# EasyEDA Pro project ProProject_P1_2024-06-12.epro, schematic Schematic2_1
Create Date: 2024-05-17; Page Name: P1; Project Name: P1; Schematic Name: Schematic2_1; Update Date: 2024-06-08; Company: 嘉立创EDA; Page Size: A3; Version: V1.0
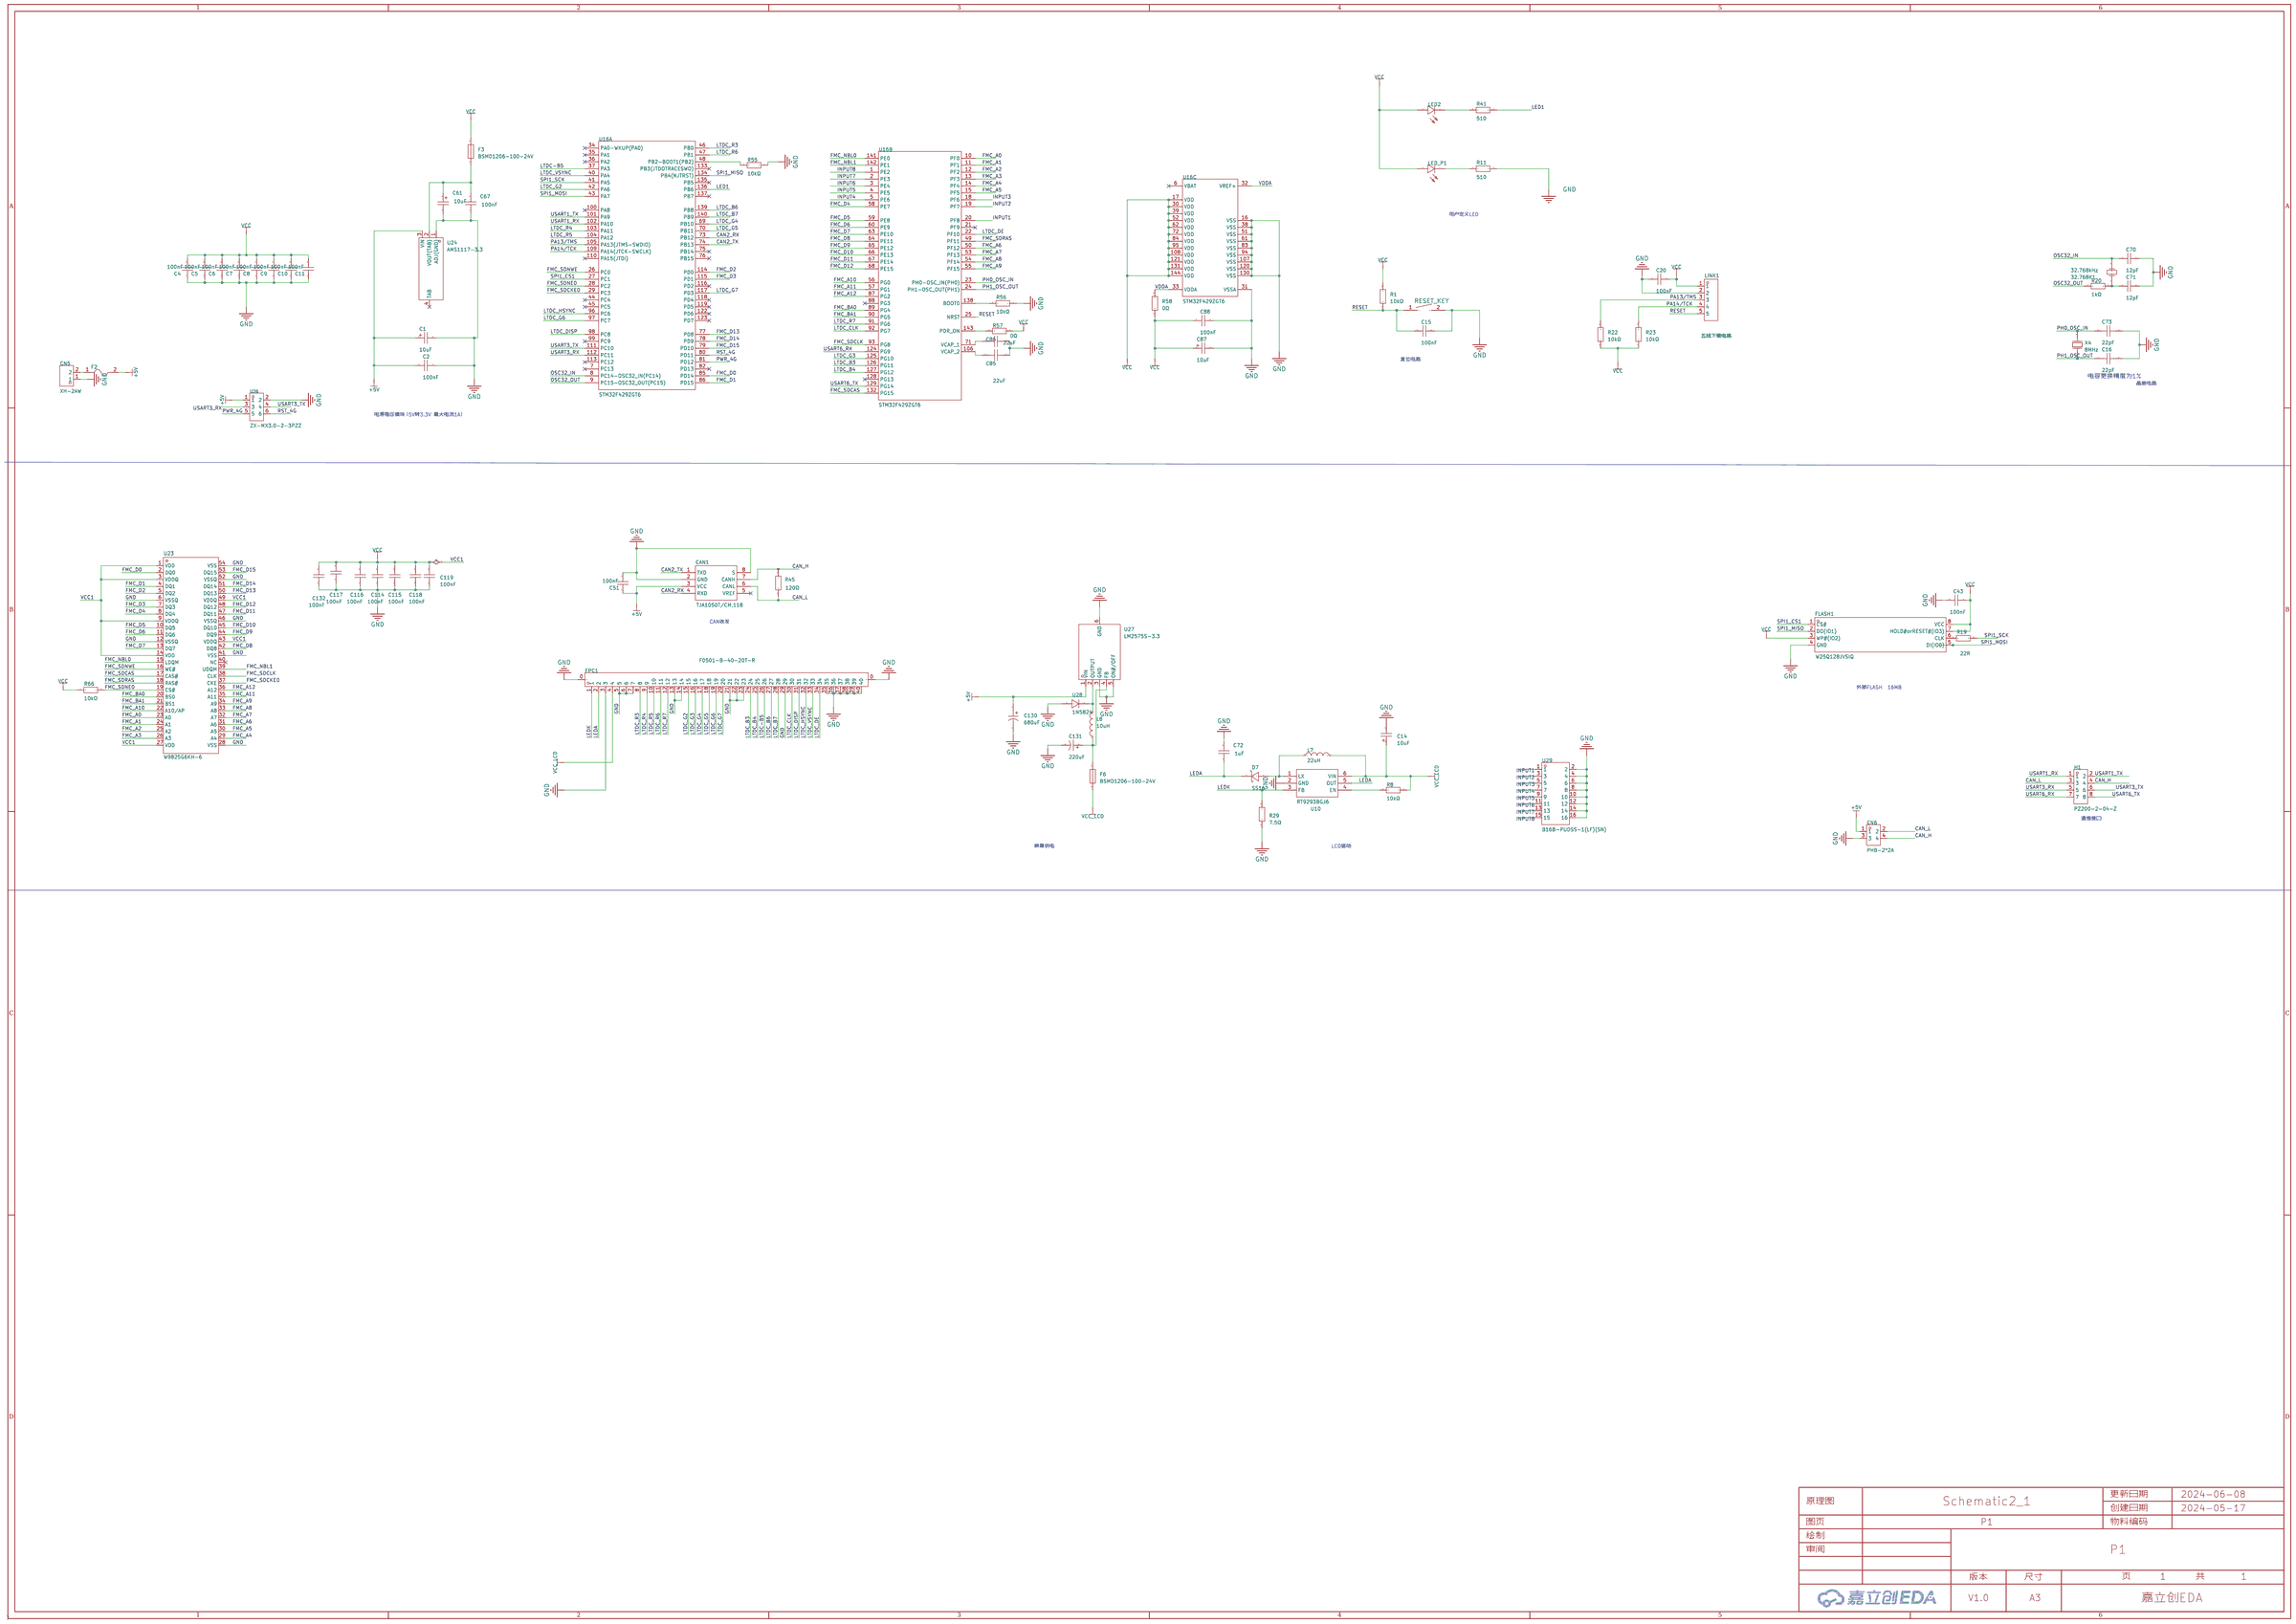
[diagram p0: schematic sheet]

## Parts
32.768K1  32.768kHz  [OSC-TH_BD2.0-P0.70-D0.3]
C1  10uF  [CAP-SMD_L3.2-W1.6-RD]
C2  100nF  [C0805]
C4  100nF  [C0805]
C5  100nF  [C0805]
C6  100nF  [C0805]
C7  100nF  [C0805]
C8  100nF  [C0805]
C9  100nF  [C0805]
C10  100nF  [C0805]
C11  100nF  [C0805]
C14  10uF  [CAP-SMD_L3.2-W1.6-RD]
C15  100nF  [C0805]
C16  22pF  [C0805]
C20  100nF  [C0805]
C43  100nF  [C0805]
C51  100nF  [C0805]
C61  10uF  [CAP-SMD_L3.2-W1.6-RD]
C67  100nF  [C0805]
C70  12pF  [C0805]
C71  12pF  [C0805]
C72  1uF  [C0805]
C73  22pF  [C0805]
C85  22uF  [C0805]
C86  22uF  [C0805]
C87  10uF  [CAP-SMD_L3.2-W1.6-RD]
C88  100nF  [C0805]
C114  100nF  [C0805]
C115  100nF  [C0805]
C116  100nF  [C0805]
C117  100nF  [C0805]
C118  100nF  [C0805]
C119  100nF  [C0805]
C130  680uF  [CAP-SMD_BD10.0-L10.3-W10.3-LS10.9-FD]
C131  220uF  [CAP-SMD_BD8.0-L8.3-W8.3-RD]
C132  100nF  [C0805]
CAN1  TJA1050T/CM,118  [SOIC-8_L5.0-W4.0-P1.27-LS6.0-BL]
CN5  XH-2AW  [CONN-TH_XH-2AW_C2908611]
CN6  PHB-2*2A  [CONN-TH_PHB-2-2A]
D7  SS16  [SMA_L4.4-W2.6-LS5.0-RD]
F2  BSMD1206-200-12V  [F1206]
F3  BSMD1206-100-24V  [F1206]
F6  BSMD1206-100-24V  [F1206]
FLASH1  W25Q128JVSIQ  [SOIC-8_L5.3-W5.3-P1.27-LS8.0-BL]
FPC1  F0501-B-40-20T-R  [FPC-SMD_40P-P0.50_L4.4-W25.6]
H1  PZ200-2-04-Z  [HDR-TH_8P-P2.00-V-M-R2-C4-S2.00]
K2  RESET_KEY  [SW-SMD_L6.1-W3.6-LS8.0]
L7  22uH  [IND-SMD_L7.3-W6.6_MHCI06030]
L8  10uH  [IND-SMD_L7.6-W7.6]
LED2  NCD0603W1  [LED0603-RD]
LED_P1  NCD0603W1  [LED0603-RD]
LINK1  五线下载电路  [HDR-TH_5P-P2.54-H-M-W10.0-N]
R1  10kΩ  [R0805]
R8  10kΩ  [R0805]
R11  510  [R0805]
R19  22R  [R0805]
R20  1kΩ  [R0805]
R22  10kΩ  [R0805]
R23  10kΩ  [R0805]
R29  7.5Ω  [R1206]
R41  510  [R0805]
R45  120Ω  [R0805]
R55  10kΩ  [R0805]
R56  10kΩ  [R0805]
R57  0Ω  [R0805]
R58  0Ω  [R0805]
R66  10kΩ  [R0805]
U10  -  [SOT-23-6_L2.9-W1.6-P0.95-LS2.8-BR]
U16  STM32F429ZGT6  [LQFP-144_L20.0-W20.0-P0.50-LS22.0-BL]  (sections 1,2,3)
U23  W9825G6KH-6  [TSOP-54_L22.2-W10.2-P0.80-LS11.8-BL]
U24  AMS1117-3.3  [SOT-223-4_L6.5-W3.5-P2.30-LS7.0-BR]
U26  ZX-MX3.0-2-3PZZ  [CONN-TH_6P-P3.00_HC-MX3.0-2X3A]
U27  LM2575S-3.3  [TO-263-5_L10.0-W8.4-P1.70-LS15.3-BR]
U28  1N5824  [DO-201AD_BD5.3-L9.5-P13.50-D1.4-RD]
U29  B16B-PUDSS-1(LF)(SN)  [CONN-TH_B16B-PUDSS-1]
X4  8MHz  [CRYSTAL-SMD_L11.5-W4.8-LS12.7]

## Library data of the parts
32.768K1 = X206032768KGB2SC: 晶振类型:圆柱体晶振;频率:32.768kHz;频率公差:±10ppm;频率稳定度:-;负载电容:12.5pF;工作温度:-20~+70;; LCSC Part Name: 32.768kHz ±10ppm 12.5pF YT-26; Supplier Part: C2236; Manufacturer: YXC扬兴科技; Supplier Footprint: DT-26; JLCPCB Part Class: Extended Part; Datasheet: https://atta.szlcsc.com/upload/public/pdf/source/20210329/C13712_F7F11DC87370623B2CDEB0B445E6F76E.pdf; Supplier: LCSC; Crystal Type: 圆柱体晶振; Frequency Tolerance: ±10ppm; Load Capacitance: 12.5pF; Operating Temperature: -20~+70
C1 C14 C61 C87 = TAJA106K010RNJ: 额定电压:10V;工作温度:-55~+125;等效串联电阻:3Ω 100kHz;容值:10uF;精度:±10%;; LCSC Part Name: 10uF ±10% 10V; Supplier Part: C7177; Manufacturer: Kyocera AVX; Supplier Footprint: CASE-A_3216; JLCPCB Part Class: Extended Part; Datasheet: https://atta.szlcsc.com/upload/public/pdf/source/20160107/1457707748330.pdf; Supplier: LCSC; Rated Voltage: 10V; Operating Temperature: -55~+125; Equivalent Series Resistance(ESR): 3Ω 100kHz; Tolerance: ±10%
C2 C4-C11 C15 C20 C43 C51 C67 C88 C114-C119 C132 = CC0805KRX7R9BB104: 容值:100nF;精度:±10%;额定电压:50V;材质(温度系数):X7R;; LCSC Part Name: 100nF ±10% 50V; Supplier Part: C49678; Manufacturer: YAGEO(国巨); Supplier Footprint: 0805; JLCPCB Part Class: Basic Part; Datasheet: https://atta.szlcsc.com/upload/public/pdf/source/20151026/1457707504898.pdf; Supplier: LCSC; Tolerance: ±10%; Voltage Rated: 50V; Temperature Coefficient: X7R
C16 C73 = 0805CG220F500NT: 容值:22pF;精度:±1%;额定电压:50V;材质(温度系数):C0G;; LCSC Part Name: 22pF ±1% 50V; Supplier Part: C190088; Manufacturer: FH(风华); Supplier Footprint: 0805; JLCPCB Part Class: Extended Part; Datasheet: https://atta.szlcsc.com/upload/public/pdf/source/20180403/C190088_56850D1EC15C808EFC445C0BB3B2CDBB.pdf; Supplier: LCSC; Tolerance: ±1%; Voltage Rated: 50V; Temperature Coefficient: C0G
C70 C71 = 0805CG120J500NT: 容值:12pF;精度:±5%;额定电压:50V;材质(温度系数):C0G;; LCSC Part Name: 12pF ±5% 50V; Supplier Part: C1792; Manufacturer: FH(风华); Supplier Footprint: 0805; JLCPCB Part Class: Basic Part; Datasheet: https://atta.szlcsc.com/upload/public/pdf/source/20170923/C1792_1506149354360988551.pdf; Supplier: LCSC; Tolerance: ±5%; Voltage Rated: 50V; Temperature Coefficient: C0G
C72 = CL21B105KBFNNNE: 容值:1uF;精度:±10%;额定电压:50V;材质(温度系数):X7R;; LCSC Part Name: 1uF ±10% 50V; Supplier Part: C28323; Manufacturer: SAMSUNG(三星); Supplier Footprint: 0805; JLCPCB Part Class: Basic Part; Datasheet: https://atta.szlcsc.com/upload/public/pdf/source/20160103/1457707718219.pdf; Supplier: LCSC; Tolerance: ±10%; Voltage Rated: 50V; Temperature Coefficient: X7R
C85 C86 = CL21A226MAYNNNE: 温度系数:X5R;额定电压:25V;精度:±20%;容值:22uF;; LCSC Part Name: 22uF ±20% 25V; Supplier Part: C602037; Manufacturer: SAMSUNG(三星); Supplier Footprint: 0805; JLCPCB Part Class: Extended Part; Datasheet: https://atta.szlcsc.com/upload/public/pdf/source/20200609/C602037_1A0D619693E608A1BF6E80154254E2DB.pdf; Supplier: LCSC; Temperature Coefficient: X5R; Voltage Rated: 25V; Tolerance: ±20%
C130 = GVM1V681M1010: 容值:680uF;精度:±20%;额定电压:35V;纹波电流:1.19A@120Hz;等效串联电阻:60mΩ@120Hz;; LCSC Part Name: 680uF ±20% 35V; Supplier Part: C2980172; Manufacturer: HONOR(荣誉); Supplier Footprint: SMD,D10xL10.5mm; JLCPCB Part Class: 扩展库; Datasheet: https://atta.szlcsc.com/upload/public/pdf/source/20220509/EB2A569F0F3393644DE07704993C28AA.pdf; Supplier: LCSC; Tolerance: ±20%; Rated Voltage: 35V; Ripple Current: 1.19A@120Hz; Equivalent Series Resistance(ESR): 60mΩ@120Hz; φD: 10mm; L: 10.2mm; Lifetime @ Temp: 5000hrs@105℃; Operating Temperature: -55℃~+105℃
C131 = CS1V221M-CRF10: 容值:220uF;精度:±20%;额定电压:35V;纹波电流:-;等效串联电阻:-;; LCSC Part Name: 220uF ±20% 35V; Supplier Part: C97814; Manufacturer: ST(先科); Supplier Footprint: SMD,D8xL10.5mm; JLCPCB Part Class: 扩展库; Datasheet: https://atta.szlcsc.com/upload/public/pdf/source/20170914/C129293_1505359937951968146.pdf; Supplier: LCSC; Tolerance: ±20%; Rated Voltage: 35V; φD: 8mm; L: 10.5mm; Lifetime @ Temp: 2000hrs@105℃; Operating Temperature: -40℃~+105℃
CAN1 = TJA1050T/CM,118: 类型:收发器;协议类别:CAN总线;; Supplier Part: C6952; Manufacturer: NXP(恩智浦); Supplier Footprint: SOIC-8_150mil; JLCPCB Part Class: Basic Part; Datasheet: https://atta.szlcsc.com/upload/public/pdf/source/20140411/1457707042917.pdf; Supplier: LCSC; Type: 收发器; Protocol: CAN总线; Supply Voltage: 4.75V ~ 5.25V
CN5 = XH-2AW_C2908611: 插针结构:1x2P;间距:2.54mm;安装方式:弯插;参考系列:XH;总PIN数:2P;排数:1;每排PIN数:2;行距:-;额定电流:3A;触头材质:黄铜;触头镀层:锡;工作温度范围:-25℃~+85℃;; LCSC Part Name: 1x2P 间距:2.54mm 弯插 系列:XH; Supplier Part: C2908611; Manufacturer: HCTL(华灿天禄); Supplier Footprint: 弯插,P=2.54mm; JLCPCB Part Class: 扩展库; Datasheet: https://atta.szlcsc.com/upload/public/pdf/source/20230711/B565BAF3B11666EF6B81B3605408F2BD.pdf; Supplier: LCSC; Pins Structure: 1x2P; Pitch: 2.54mm; Mounting Style: 弯插; Reference Series: XH; Number of Pins: 2P; Number of Rows: 1; Number of PINs Per Row: 2; Current Rating (Max): 3A; Contact Material: 黄铜; Contact Plating: 锡; Operating Temperature Range: -25℃~+85℃
CN6 = PHB-2*2A_C722944: 插针结构:2x2P;间距:2mm;安装方式:直插;参考系列:-;总PIN数:4P;排数:2;每排PIN数:2;行距:2mm;额定电流:2A;工作温度范围:-25℃~+85℃;; LCSC Part Name: 2x2P 间距:2mm 直插; Supplier Part: C722944; Manufacturer: CAX(创都); Supplier Footprint: 插件,P=2mm; JLCPCB Part Class: 扩展库; Datasheet: https://atta.szlcsc.com/upload/public/pdf/source/20220624/C175EBC2626E0856603CFFC6A18F53BC.pdf; Supplier: LCSC; Pins Structure: 2x2P; Pitch: 2mm; Mounting Style: 直插; Number of Pins: 4P; Number of Rows: 2; Number of PINs Per Row: 2; Row Spacing: 2mm; Current Rating (Max): 2A; Operating Temperature Range: -25℃~+85℃
D7 = SS16_C408259: 正向压降(Vf):700mV@1A;直流反向耐压(Vr):60V;平均整流电流(Io):1A;; LCSC Part Name: 电压:60V 电流:1A; Supplier Part: C408259; Manufacturer: Slkor(萨科微); Supplier Footprint: SMA(DO-214AC); JLCPCB Part Class: 扩展库; Datasheet: https://atta.szlcsc.com/upload/public/pdf/source/20190729/C408259_D3DE34C09D6DBB5845773DDABD83847F.pdf; Supplier: LCSC; Forward Voltage (Vf@If): 700mV@1A; Reverse Voltage (Vr): 60V; Average Rectified Current (Io): 1A
F2 = BSMD1206-200-12V: 最大电压:12V;最大电流:100A;保持电流:2A;跳闸电流:3.5A;; LCSC Part Name: 12V 2A 1206自恢复; Supplier Part: C883135; Manufacturer: BHFUSE(佰宏); Supplier Footprint: 1206; JLCPCB Part Class: 扩展库; Datasheet: https://atta.szlcsc.com/upload/public/pdf/source/20230512/E419278EC8529AAF514173EF221BCF4B.pdf; Supplier: LCSC; Operating Voltage (Max): 12V; Current Rating (Max): 100A; Hold Current: 2A; Trip Current: 3.5A; Power Dissipation: 1W; Resistance - Initial (Ri) (Min): 15mΩ; Resistance - Post Trip (R1) (Max): 80mΩ; Maximum Time to Trip: 1.5s; Operating Temperature: -40℃~+85℃
F3 F6 = BSMD1206-100-24V: 最大电压:24V;最大电流:40A;保持电流:1A;跳闸电流:1.8A;; LCSC Part Name: 1206 1A 24V 佰宏高电压; Supplier Part: C910830; Manufacturer: BHFUSE(佰宏); Supplier Footprint: 1206; JLCPCB Part Class: 扩展库; Datasheet: https://atta.szlcsc.com/upload/public/pdf/source/20230512/E419278EC8529AAF514173EF221BCF4B.pdf; Supplier: LCSC; Operating Voltage (Max): 24V; Current Rating (Max): 40A; Hold Current: 1A; Trip Current: 1.8A; Power Dissipation: 1W; Resistance - Initial (Ri) (Min): 50mΩ; Resistance - Post Trip (R1) (Max): 270mΩ; Maximum Time to Trip: 300ms; Operating Temperature: -40℃~+85℃
FLASH1 = W25Q128JVSIQ_C113767: Supplier Part: C113767; Manufacturer: WINBOND(华邦); Supplier Footprint: SOIC-8-208mil; JLCPCB Part Class: Extended Part; Datasheet: https://atta.szlcsc.com/upload/public/pdf/source/20180329/C113767_097B64D788F6E3FFB2E9CB46CB6C1427.pdf; Supplier: LCSC
FPC1 = F0501-B-40-20T-R: 锁定特性:抽屉式;触点类型:下接;触点数量:40P;间距:0.5mm;安装类型:卧贴;; LCSC Part Name: 间距:0.5mm P数:40P 抽屉式 下接; Supplier Part: C481234; Manufacturer: XFCN(兴飞); Supplier Footprint: SMD,P=0.5mm,卧贴; JLCPCB Part Class: 扩展库; Datasheet: https://atta.szlcsc.com/upload/public/pdf/source/20200107/C481235_885C0C9048A71D2F9507D81192DE73EF.pdf; Supplier: LCSC; Locking Feature: 抽屉式; Contact Type: 下接; Number of Contacts: 40P; Pitch: 0.5mm; Mounting Type: 卧贴; Height Above Board: 2mm
H1 = PZ200-2-04-Z: 插针结构:2x4P;间距:2mm;行距:2mm;圆针/方针:方针;安装类型:直插;排数:双排;总PIN位数:8P;额定电流:1.5A;额定电压:-;配合针长度:4mm;塑高:2mm;端接针长度:2.8mm;触头材质:黄铜;工作温度范围:-40℃~+105℃;焊接温度(最大值):260℃@5S;颜色:黑色;; LCSC Part Name: 2x4P 间距:2mm 方针 直插; Supplier Part: C2905990; Manufacturer: HCTL(华灿天禄); Supplier Footprint: 插件,P=2mm; JLCPCB Part Class: 扩展库; Datasheet: https://atta.szlcsc.com/upload/public/pdf/source/20230609/E9B292E9F4F82C2859D5665FE1B563FB.pdf; Supplier: LCSC; Pin Structure: 2x4P; Pitch: 2mm; Row Spacing: 2mm; Circluar Pins/Square Pins: 方针; Mounting Type: 直插; Number of Rows: 双排; Number of Pins: 8P; Current Rating (Max): 1.5A; Length of Mating Pin: 4mm; Insulation Height: 2mm; Length of End Connection Pin: 2.8mm; Contact Material: 黄铜; Operating Temperature Range: -40℃~+105℃; Soldering Temperature(Max): 260℃@5S; Color: 黑色
K2 = TSA363G25-250B: 触点电流:50mA;额定电压(DC):12V;绝缘电阻:100MΩ;电路结构:单刀单掷;安装方式:立贴;按钮形状:矩形按钮;按钮/盖帽颜色:白色;带灯:无;作用力:250gf@±50gf;机械寿命:50000;工作温度:-25~+70;引脚样式:鸥翼型;开关长度:6.05mm;开关宽度:3.6mm;开关高度:2.5mm;带支架:否;; LCSC Part Name: 3*6*2.5  白柄贴片  250gf; Supplier Part: C354943; Manufacturer: BRIGHT(博瑞泰); Supplier Footprint: SMD; JLCPCB Part Class: Extended Part; Datasheet: https://atta.szlcsc.com/upload/public/pdf/source/20190426/C354943_F8D02988919B0D3B4D493E3C3D798834.pdf; Supplier: LCSC; Contact Current: 50mA; Voltage Rating (DC): 12V; Insulation Resistance: 100MΩ; Circuit: 单刀单掷; Mounting Style: 立贴; Actuator Style: 矩形按钮; Actuator/Cap Color: 白色; With Lamp: 无; Operating Force: 250gf@±50gf; Mechanical Life: 50000; Operating Temperature: -25~+70; Pin Style: 鸥翼型; Switch Length: 6.05mm; Switch Width: 3.6mm; Switch Height: 2.5mm; Strike Gundam: 否
L7 = SMMS0630-220M: 电感值:22uH;精度:±20%;额定电流:-;饱和电流(Isat):3.5A;类型:一体成型电感;; LCSC Part Name: 22uH ±20% 3.5A; Supplier Part: C128694; Manufacturer: SXN(顺翔诺); Supplier Footprint: SMD,6.6x7.3mm; JLCPCB Part Class: 扩展库; Datasheet: https://atta.szlcsc.com/upload/public/pdf/source/20210810/BBF24330FB2F5029F637830BA9C42C0D.pdf; Supplier: LCSC; Tolerance: ±20%; Saturation Current (Isat): 3.5A; DC Resistance (DCR): 135mΩ; Type: 一体成型电感
L8 = B1047AS-100M=P3: 电感值:10uH;精度:±20%;额定电流:2.7A;饱和电流(Isat):-;直流电阻(DCR):53mΩ;; LCSC Part Name: 10uH ±20%; Supplier Part: C160959; Manufacturer: muRata(村田); Supplier Footprint: SMD,7.3x7.3mm; JLCPCB Part Class: 扩展库; Datasheet: https://atta.szlcsc.com/upload/public/pdf/source/20180122/C160959_15166126137741291243.pdf; Supplier: LCSC; Tolerance: ±20%; Rated Current: 2.7A; DC Resistance (DCR): 53mΩ
LED2 LED_P1 = NCD0603W1: 发光颜色:白灯;; LCSC Part Name: 白灯; Supplier Part: C84265; Manufacturer: 国星光电; Supplier Footprint: 0603; JLCPCB Part Class: Extended Part; Datasheet: https://atta.szlcsc.com/upload/public/pdf/source/20200820/C84265_479E6193713348A548E5CD6D9278BF16.pdf; Supplier: LCSC; Emitted Color: 白灯
LINK1 = DZ254W-11-05-65: 间距:2.54mm;总PIN位数:5;排数:1;插针结构:1x5P;行距:-;安装类型:弯插;圆针/方针:方针;额定电流:3A;额定电压:-;配合针长度:6mm;塑高:2.54mm;端接针长度:-;工作温度范围:-;颜色:-;; LCSC Part Name: 2.54mm 1x5P 弯插 方针; Supplier Part: C2935930; Manufacturer: DEALON(德艺隆); Supplier Footprint: 弯插,P=2.54mm; JLCPCB Part Class: Extended Part; Datasheet: https://atta.szlcsc.com/upload/public/pdf/source/20211231/CEC96EEC99F3217E207F74B399519373.pdf; Supplier: LCSC; Pitch: 2.54mm; Number of Pins: 5; Number of Rows: 1; Pin Structure: 1x5P; Mounting Type: 弯插; Circluar Pins/Square Pins: 方针; Current Rating (Max): 3A; Length of Mating Pin: 6mm; Insulation Height: 2.54mm
R1 R8 R22 R23 R55 R56 R66 = 0805W8F1002T5E_C17414: 电阻类型:厚膜电阻;阻值:10kΩ;精度:±1%;功率:1/8W;温度系数:±100ppm/;最大工作电压:150V;工作温度范围:-55~+155;; LCSC Part Name: 10kΩ ±1% 1/8W; Supplier Part: C17414; Manufacturer: UNI-ROYAL(厚声); Manufacturer Part: 0805W8F1002T5E; Supplier Footprint: 0805; JLCPCB Part Class: Basic Part; Datasheet: https://atta.szlcsc.com/upload/public/pdf/source/20200306/C422600_1E6D84923E4A46A82E41ADD87F860B5C.pdf; Supplier: LCSC; Type: 厚膜电阻; Tolerance: ±1%; Power(Watts): 1/8W; Temperature Coefficient: ±100ppm/; Overload Voltage (Max): 150V; Operating Temperature Range: -55~+155
R11 R41 = 0805W8F5100T5E: LCSC Part Name: 510Ω(5100) ±1% 编带; Supplier Part: C17734; Manufacturer: UNI-ROYAL(厚声); Supplier Footprint: 0805; JLCPCB Part Class: Basic Part; Datasheet: https://atta.szlcsc.com/upload/public/pdf/source/20170920/C17734_1505887219813980088.pdf; Supplier: LCSC
R19 = 0805W8F220JT5E: LCSC Part Name: 22Ω(22R0) ±1% 编带; Supplier Part: C17561; Manufacturer: UNI-ROYAL(厚声); Supplier Footprint: 0805; JLCPCB Part Class: Basic Part; Datasheet: https://atta.szlcsc.com/upload/public/pdf/source/20170920/C17561_1505887138086979919.pdf; Supplier: LCSC
R20 = 0805W8F1001T5E: 电阻类型:厚膜电阻;阻值:1kΩ;精度:±1%;功率:125mW;温度系数:±100ppm/;最大工作电压:150V;工作温度范围:-55~+155;; LCSC Part Name: 1kΩ ±1% 125mW; Supplier Part: C17513; Manufacturer: UNI-ROYAL(厚声); Supplier Footprint: 0805; JLCPCB Part Class: Basic Part; Datasheet: https://atta.szlcsc.com/upload/public/pdf/source/20200306/C422600_1E6D84923E4A46A82E41ADD87F860B5C.pdf; Supplier: LCSC; Type: 厚膜电阻; Tolerance: ±1%; Power(Watts): 125mW; Temperature Coefficient: ±100ppm/; Overload Voltage (Max): 150V; Operating Temperature Range: -55~+155
R29 = 1206W4F750KT5E: 功率:1/4W;精度:±1%;温度系数:±200ppm/;阻值:7.5Ω;最大工作电压:200V;工作温度范围:-55~+155;; LCSC Part Name: 7.5Ω ±1%; Supplier Part: C17977; Manufacturer: UNI-ROYAL(厚声); Supplier Footprint: 1206; JLCPCB Part Class: Extended Part; Datasheet: https://atta.szlcsc.com/upload/public/pdf/source/20170920/C17977_1505887336847980325.pdf; Supplier: LCSC; Power(Watts): 1/4W; Tolerance: ±1%; Temperature Coefficient: ±200ppm/; Overload Voltage (Max): 200V; Operating Temperature Range: -55~+155
R45 = 0805W8F1200T5E: 电阻类型:厚膜电阻;阻值:120Ω;精度:±1%;功率:125mW;温度系数:±100ppm/℃;最大工作电压:150V;工作温度范围:-55℃~+155℃;; LCSC Part Name: 120Ω ±1% 125mW; Supplier Part: C17437; Manufacturer: UNI-ROYAL(厚声); Supplier Footprint: 0805; JLCPCB Part Class: Basic Part; Datasheet: https://atta.szlcsc.com/upload/public/pdf/source/20200306/C422600_1E6D84923E4A46A82E41ADD87F860B5C.pdf; Supplier: LCSC; Type: 厚膜电阻; Tolerance: ±1%; Power(Watts): 125mW; Temperature Coefficient: ±100ppm/℃; Overload Voltage (Max): 150V; Operating Temperature Range: -55℃~+155℃
R57 R58 = 0805W8F0000T5E: 精度:±1%;温度系数:±800ppm/;阻值:0Ω;功率:0.125W;; LCSC Part Name: 0Ω ±1%; Supplier Part: C17477; Manufacturer: UNI-ROYAL(厚声); Supplier Footprint: 0805; JLCPCB Part Class: Basic Part; Datasheet: https://atta.szlcsc.com/upload/public/pdf/source/20170920/C17477_1505887096936979836.pdf; Supplier: LCSC; Tolerance: ±1%; Temperature Coefficient: ±800ppm/; Power(Watts): 0.125W
U10 = RT9293BGJ6: 类型:-;拓扑结构:-;内部开关:-;供电电压（最低）:-;供电电压（最高）:-;频率:-;; Supplier Part: C36462; Manufacturer: RICHTEK(台湾立锜); Supplier Footprint: SOT-23-6; JLCPCB Part Class: Extended Part; Datasheet: https://atta.szlcsc.com/upload/public/pdf/source/20140924/1457707240143.pdf; Supplier: LCSC
U16 = STM32F429ZGT6: CPU内核:CM4;程序存储容量:1MB;GPIO端口数量:114;工作电压范围:1.8V~3.6V;CPU最大主频:180MHz;程序存储器类型:-;; Supplier Part: C46525; Manufacturer: ST(意法半导体); Supplier Footprint: LQFP-144(20x20); Datasheet: https://atta.szlcsc.com/upload/public/pdf/source/20170102/1483323670635.pdf; Supplier: LCSC; CPU Core: CM4; Program Storage Size: 1MB; GPIO Ports Number: 114; Operating Voltage Range: 1.8V~3.6V; CPU Maximum Speed: 180MHz; Operating Temperature Range: -40℃~+85℃; ADC (Bit): 12bit; DAC (Bit): 12bit; Universal Serial Bus: 有; Watchdog: 有; Infrared Data Association: 有; Low-Voltage Detect: 有; LCD Module: 有; Direct Memory Access: 有; Internal Oscillator: 有
U23 = W9825G6KH-6: Supplier Part: C62246; Manufacturer: WINBOND(华邦); Supplier Footprint: TSOP-54-10.2mm; JLCPCB Part Class: 扩展库; Datasheet: https://atta.szlcsc.com/upload/public/pdf/source/20170316/1489630415513.pdf; Supplier: LCSC
U24 = AMS1117-3.3_C347222: 输出类型:固定;最大输入电压:12V;输出电压:3.3V;最大输出电流:1A;电源纹波抑制比(PSRR):60dB@(120Hz);输出极性:正极;; LCSC Part Name: 输出:3.3V 电流:1A 耐压:12V; Supplier Part: C347222; Manufacturer: UMW(友台半导体); Supplier Footprint: SOT-223; JLCPCB Part Class: 扩展库; Datasheet: https://atta.szlcsc.com/upload/public/pdf/source/20231109/155D79A26D9DB04352555A58D5969DC8.pdf; Supplier: LCSC; Output Type: 固定; Maximum Input Voltage: 12V; Output Voltage: 3.3V; MAX Output Current: 1A; Power Supply Rejection Ratio (PSRR): 60dB@(120Hz); Dropout Voltage: 1.3V@(1A); Output Polarity: 正极; Number of Outputs: 1
U26 = ZX-MX3.0-2-3PZZ: 插针结构:2x3P;间距:3mm;安装方式:直插;参考系列:-;总PIN数:6P;排数:2;每排PIN数:3;行距:3mm;额定电流:5A;触头材质:铜合金;触头镀层:锡;工作温度范围:-25℃~+85℃;; LCSC Part Name: 2x3P 间距:3mm 直插; Supplier Part: C7541614; Manufacturer: Megastar(兆星); Supplier Footprint: 插件,P=3mm; Datasheet: https://atta.szlcsc.com/upload/public/pdf/source/20230825/3D5AC4D1868451CE06754DA85FDF6AB5.pdf; Supplier: LCSC; Pins Structure: 2x3P; Pitch: 3mm; Mounting Style: 直插; Number of Pins: 6P; Number of Rows: 2; Number of PINs Per Row: 3; Row Spacing: 3mm; Current Rating (Max): 5A; Contact Material: 铜合金; Contact Plating: 锡; Operating Temperature Range: -25℃~+85℃
U27 = LM2575S-3.3: 功能类型:降压型;输出类型:固定;输入电压:40V;输出电压:3.3V;输出电流(最大值):2A;; Supplier Part: C347404; Manufacturer: UMW(友台半导体); Supplier Footprint: TO-263-5; JLCPCB Part Class: 扩展库; Datasheet: https://atta.szlcsc.com/upload/public/pdf/source/20221111/31B0C20E558954BB4B875F26A62E318D.pdf; Supplier: LCSC; Function: 降压型; Output Type: 固定; Input Voltage: 40V; Output Voltage: 3.3V; Output Current (Max): 2A; Switching Frequency: 150kHz; Operating Temperature: -40℃~+125℃@(TJ); Synchronous Rectification: 否; Number of Outputs: 1; Topology: 降压式; Switch tube (built-in/external): 内置
U28 = 1N5824_C508482: 正向压降(Vf):550mV@5A;直流反向耐压(Vr):30V;平均整流电流(Io):5A;; LCSC Part Name: 电压:30V 电流:5A; Supplier Part: C508482; Manufacturer: SUNMATE(森美特); Supplier Footprint: DO-201AD; JLCPCB Part Class: 扩展库; Datasheet: https://atta.szlcsc.com/upload/public/pdf/source/20221227/441F99ACBA92F0F60BC9165D802C5793.pdf; Supplier: LCSC; Forward Voltage (Vf@If): 550mV@5A; Reverse Voltage (Vr): 30V; Average Rectified Current (Io): 5A; Peak forward surge current: 150A
U29 = B16B-PUDSS-1(LF)(SN): 插针结构:2x8P;间距:2mm;安装方式:直插;参考系列:-;总PIN数:16P;排数:2;每排PIN数:8;行距:2mm;额定电流:3A;工作温度范围:-25℃~+85℃;; LCSC Part Name: 2x8P 间距:2mm 直插; Supplier Part: C545745; Manufacturer: JST; Supplier Footprint: 插件,P=2mm; JLCPCB Part Class: 扩展库; Datasheet: https://atta.szlcsc.com/upload/public/pdf/source/20200710/C545745_1C4861CABD9D160B3B1E3B8CD6F593BF.pdf; Supplier: LCSC; Pins Structure: 2x8P; Pitch: 2mm; Mounting Style: 直插; Number of Pins: 16P; Number of Rows: 2; Number of PINs Per Row: 8; Row Spacing: 2mm; Current Rating (Max): 3A; Operating Temperature Range: -25℃~+85℃
X4 = X49SM8MSD2SC: 晶振类型:49SMD;频率:8MHz;频率公差:±20ppm;频率稳定度:±30ppm;负载电容:20pF;工作温度:-20~+70;; LCSC Part Name: HC-49SMD 8MHz ±20ppm 20pF; Supplier Part: C12674; Manufacturer: YXC(扬兴科技); Supplier Footprint: HC-49S-SMD-2P; JLCPCB Part Class: Basic Part; Datasheet: https://atta.szlcsc.com/upload/public/pdf/source/20210329/C106809_0E91E60850A780B284B63D653DC40EA4.pdf; Supplier: LCSC; Crystal Type: 49SMD; Frequency Tolerance: ±20ppm; Frequency Stability: ±30ppm; Load Capacitance: 20pF; Operating Temperature: -20~+70

## Nets
+5V: C1.1 C2.2 C51.1 C130.1 CAN1.3(VCC) CN6.1 F2.2 U24.3(VIN) U26.1 U27.1(VIN)
GND: C1.2 C2.1 C4.1 C5.1 C6.1 C7.1 C8.1 C9.1 C10.1 C11.1 C14.2 C15.1 C16.2 C20.2 C43.2 C51.2 C61.2 C67.1 C70.2 C71.2 C72.2 C73.2 C85.2 C86.2 C87.2 C88.1 C114.1 C115.1 C116.1 C117.1 C118.1 C119.1 C130.2 C131.2 C132.1 CAN1.2(GND) CAN1.8(S) CN5.1 CN6.3 FLASH1.4(GND) FPC1.0 FPC1.3 FPC1.5 FPC1.6 FPC1.7 FPC1.13 FPC1.14 FPC1.21 FPC1.22 FPC1.23 FPC1.29 FPC1.35 FPC1.36 FPC1.37 FPC1.38 FPC1.39 FPC1.40 K2.2 LINK1.2 R11.2 R29.1 R55.1 R56.2 U10.2(GND) U16.16(VSS) U16.31(VSSA) U16.38(VSS) U16.51(VSS) U16.61(VSS) U16.83(VSS) U16.94(VSS) U16.107(VSS) U16.120(VSS) U16.130(VSS) U23.6(VSSQ) U23.12(VSSQ) U23.28(VSS) U23.41(VSS) U23.46(VSSQ) U23.52(VSSQ) U23.54(VSS) U24.1(ADJ(GND)) U26.2 U27.3(GND) U27.5(ON#/OFF) U27.6(GND) U28.2 U29.2 U29.4 U29.6 U29.8 U29.10 U29.12 U29.14 U29.16
VCC: C4.2 C5.2 C6.2 C7.2 C8.2 C9.2 C10.2 C11.2 C20.1 C43.1 C87.1 C88.2 C114.2 C115.2 C116.2 C117.2 C118.2 C119.2 C132.2 F3.2 FLASH1.3(WP#(IO2)) FLASH1.7(HOLD#orRESET#(IO3)) FLASH1.8(VCC) LED2.2(+) LED_P1.2(+) LINK1.1 R1.2 R22.1 R23.1 R57.1 R58.1 R66.1 U16.17(VDD) U16.30(VDD) U16.39(VDD) U16.52(VDD) U16.62(VDD) U16.72(VDD) U16.84(VDD) U16.95(VDD) U16.108(VDD) U16.121(VDD) U16.131(VDD) U16.144(VDD) U23.1(VDD) U23.3(VDDQ) U23.9(VDDQ) U23.14(VDD) U23.27(VDD) U23.43(VDDQ) U23.49(VDDQ)
VCC_LCD: C14.1 F6.2 FPC1.4 L7.2 R8.1 U10.6(VIN)
VDDA: R58.2 U16.32(VREF+) U16.33(VDDA)
CAN2_RX: CAN1.4(RXD) U16.73(PB12)
CAN2_TX: CAN1.1(TXD) U16.74(PB13)
CAN_H: CAN1.7(CANH) CN6.4 H1.4 R45.2
CAN_L: CAN1.6(CANL) CN6.2 H1.3 R45.1
FMC_A0: U16.10(PF0) U23.23(A0)
FMC_A1: U16.11(PF1) U23.24(A1)
FMC_A2: U16.12(PF2) U23.25(A2)
FMC_A3: U16.13(PF3) U23.26(A3)
FMC_A4: U16.14(PF4) U23.29(A4)
FMC_A5: U16.15(PF5) U23.30(A5)
FMC_A6: U16.50(PF12) U23.31(A6)
FMC_A7: U16.53(PF13) U23.32(A7)
FMC_A8: U16.54(PF14) U23.33(A8)
FMC_A9: U16.55(PF15) U23.34(A9)
FMC_A10: U16.56(PG0) U23.22(A10/AP)
FMC_A11: U16.57(PG1) U23.35(A11)
FMC_A12: U16.87(PG2) U23.36(A12)
FMC_BA0: U16.89(PG4) U23.20(BS0)
FMC_BA1: U16.90(PG5) U23.21(BS1)
FMC_D0: U16.85(PD14) U23.2(DQ0)
FMC_D1: U16.86(PD15) U23.4(DQ1)
FMC_D2: U16.114(PD0) U23.5(DQ2)
FMC_D3: U16.115(PD1) U23.7(DQ3)
FMC_D4: U16.58(PE7) U23.8(DQ4)
FMC_D5: U16.59(PE8) U23.10(DQ5)
FMC_D6: U16.60(PE9) U23.11(DQ6)
FMC_D7: U16.63(PE10) U23.13(DQ7)
FMC_D8: U16.64(PE11) U23.42(DQ8)
FMC_D9: U16.65(PE12) U23.44(DQ9)
FMC_D10: U16.66(PE13) U23.45(DQ10)
FMC_D11: U16.67(PE14) U23.47(DQ11)
FMC_D12: U16.68(PE15) U23.48(DQ12)
FMC_D13: U16.77(PD8) U23.50(DQ13)
FMC_D14: U16.78(PD9) U23.51(DQ14)
FMC_D15: U16.79(PD10) U23.53(DQ15)
FMC_NBL0: U16.141(PE0) U23.15(LDQM)
FMC_NBL1: U16.142(PE1) U23.39(UDQM)
FMC_SDCAS: U16.132(PG15) U23.17(CAS#)
FMC_SDCKE0: U16.29(PC3) U23.37(CKE)
FMC_SDCLK: U16.93(PG8) U23.38(CLK)
FMC_SDNE0: R66.2 U16.28(PC2) U23.19(CS#)
FMC_SDNWE: U16.26(PC0) U23.16(WE#)
FMC_SDRAS: U16.49(PF11) U23.18(RAS#)
INPUT1: U16.20(PF8) U29.1
INPUT2: U16.19(PF7) U29.3
INPUT3: U16.18(PF6) U29.5
INPUT4: U16.5(PE6) U29.7
INPUT5: U16.4(PE5) U29.9
INPUT6: U16.3(PE4) U29.11
INPUT7: U16.2(PE3) U29.13
INPUT8: U16.1(PE2) U29.15
LED1: R41.2 U16.136(PB6)
LEDA: C72.1 D7.1(C) FPC1.2 U10.5(OUT)
LEDK: FPC1.1 R29.2 U10.3(FB)
LTDC-B5: FPC1.26 U16.37(PA3)
LTDC_B3: FPC1.24 U16.126(PG11)
LTDC_B4: FPC1.25 U16.127(PG12)
LTDC_B6: FPC1.27 U16.139(PB8)
LTDC_B7: FPC1.28 U16.140(PB9)
LTDC_CLK: FPC1.30 U16.92(PG7)
LTDC_DE: FPC1.34 U16.22(PF10)
LTDC_DISP: FPC1.31 U16.98(PC8)
LTDC_G2: FPC1.15 U16.42(PA6)
LTDC_G3: FPC1.16 U16.125(PG10)
LTDC_G4: FPC1.17 U16.69(PB10)
LTDC_G5: FPC1.18 U16.70(PB11)
LTDC_G6: FPC1.19 U16.97(PC7)
LTDC_G7: FPC1.20 U16.117(PD3)
LTDC_HSYNC: FPC1.32 U16.96(PC6)
LTDC_R3: FPC1.8 U16.46(PB0)
LTDC_R4: FPC1.9 U16.103(PA11)
LTDC_R5: FPC1.10 U16.104(PA12)
LTDC_R6: FPC1.11 U16.47(PB1)
LTDC_R7: FPC1.12 U16.91(PG6)
LTDC_VSYNC: FPC1.33 U16.40(PA4)
OSC32_IN: 32.768K1.2(OSC2) C70.1 U16.8(PC14-OSC32_IN(PC14))
OSC32_OUT: R20.2 U16.9(PC15-OSC32_OUT(PC15))
PA13/TMS: LINK1.3 R22.2 U16.105(PA13(JTMS-SWDIO))
PA14/TCK: LINK1.4 R23.2 U16.109(PA14(JTCK-SWCLK))
PH0_OSC_IN: C73.1 U16.23(PH0-OSC_IN(PH0)) X4.1(OSC1)
PH1_OSC_OUT: C16.1 U16.24(PH1-OSC_OUT(PH1)) X4.2(OSC2)
PWR_4G: U16.81(PD12) U26.5
RESET: C15.2 K2.1 LINK1.5 R1.1 U16.25(NRST)
RST_4G: U16.80(PD11) U26.6
SPI1_CS1: FLASH1.1(CS#) U16.27(PC1)
SPI1_MISO: FLASH1.2(DO(IO1)) U16.134(PB4(NJTRST))
SPI1_MOSI: FLASH1.5(DI(IO0)) U16.43(PA7)
SPI1_SCK: R19.2 U16.41(PA5)
USART1_RX: H1.1 U16.102(PA10)
USART1_TX: H1.2 U16.101(PA9)
USART3_RX: H1.5 U16.112(PC11) U26.3
USART3_TX: H1.6 U16.111(PC10) U26.4
USART6_RX: H1.7 U16.124(PG9)
USART6_TX: H1.8 U16.129(PG14)
$1N34149: LED2.1(-) R41.1
$1N34157: LED_P1.1(-) R11.1
$1N34166: R8.2 U10.4(EN)
$1N34241: 32.768K1.1(OSC1) C71.1 R20.1
$1N34326: FLASH1.6(CLK) R19.1
$1N34328: D7.2(A) L7.1 U10.1(LX)
$1N34463: R55.2 U16.48(PB2-BOOT1(PB2))
$1N34470: R56.1 U16.138(BOOT0)
$1N34473: C86.1 U16.71(VCAP_1)
$1N34474: R57.2 U16.143(PDR_ON)
$1N34492: C85.1 U16.106(VCAP_2)
$1N170390: C61.1 C67.2 F3.1 U24.2(VOUT(TAB))
$1N192193: L8.2 U27.2(OUTPUT) U28.1
$1N192492: C131.1 F6.1 L8.1 U27.4(FB)
$1N195028: CN5.2 F2.1

Not connected (* = marked no-connect by the designer): CAN1 5(VREF)*; U16 6(VBAT)* 7(PC13)* 21(PF9)* 34(PA0-WKUP(PA0))* 35(PA1)* 36(PA2)* 44(PC4)* 45(PC5)* 75(PB14)* 76(PB15)* 82(PD13)* 88(PG3)* 99(PC9)* 100(PA8)* 110(PA15(JTDI))* 113(PC12)* 116(PD2)* 118(PD4)* 119(PD5)* 122(PD6)* 123(PD7)* 128(PG13)* 133(PB3(JTDOTRACESWO))* 135(PB5)* 137(PB7)*; U23 40(NC)*; U24 4(TAB)*

## Notes on the sheet
- 用户定义LED
- 复位电路
- 电容更换精度为1%
- 晶振电路
- 电源稳压模块（5V转3.3V 最大电流1A）
- CAN收发
- 外部FLASH  16MB
- 通信接口
- 屏幕供电
- LCD驱动
